# EAGLE design ece411-t10-ChargerBase (EAGLE 7.2.0)
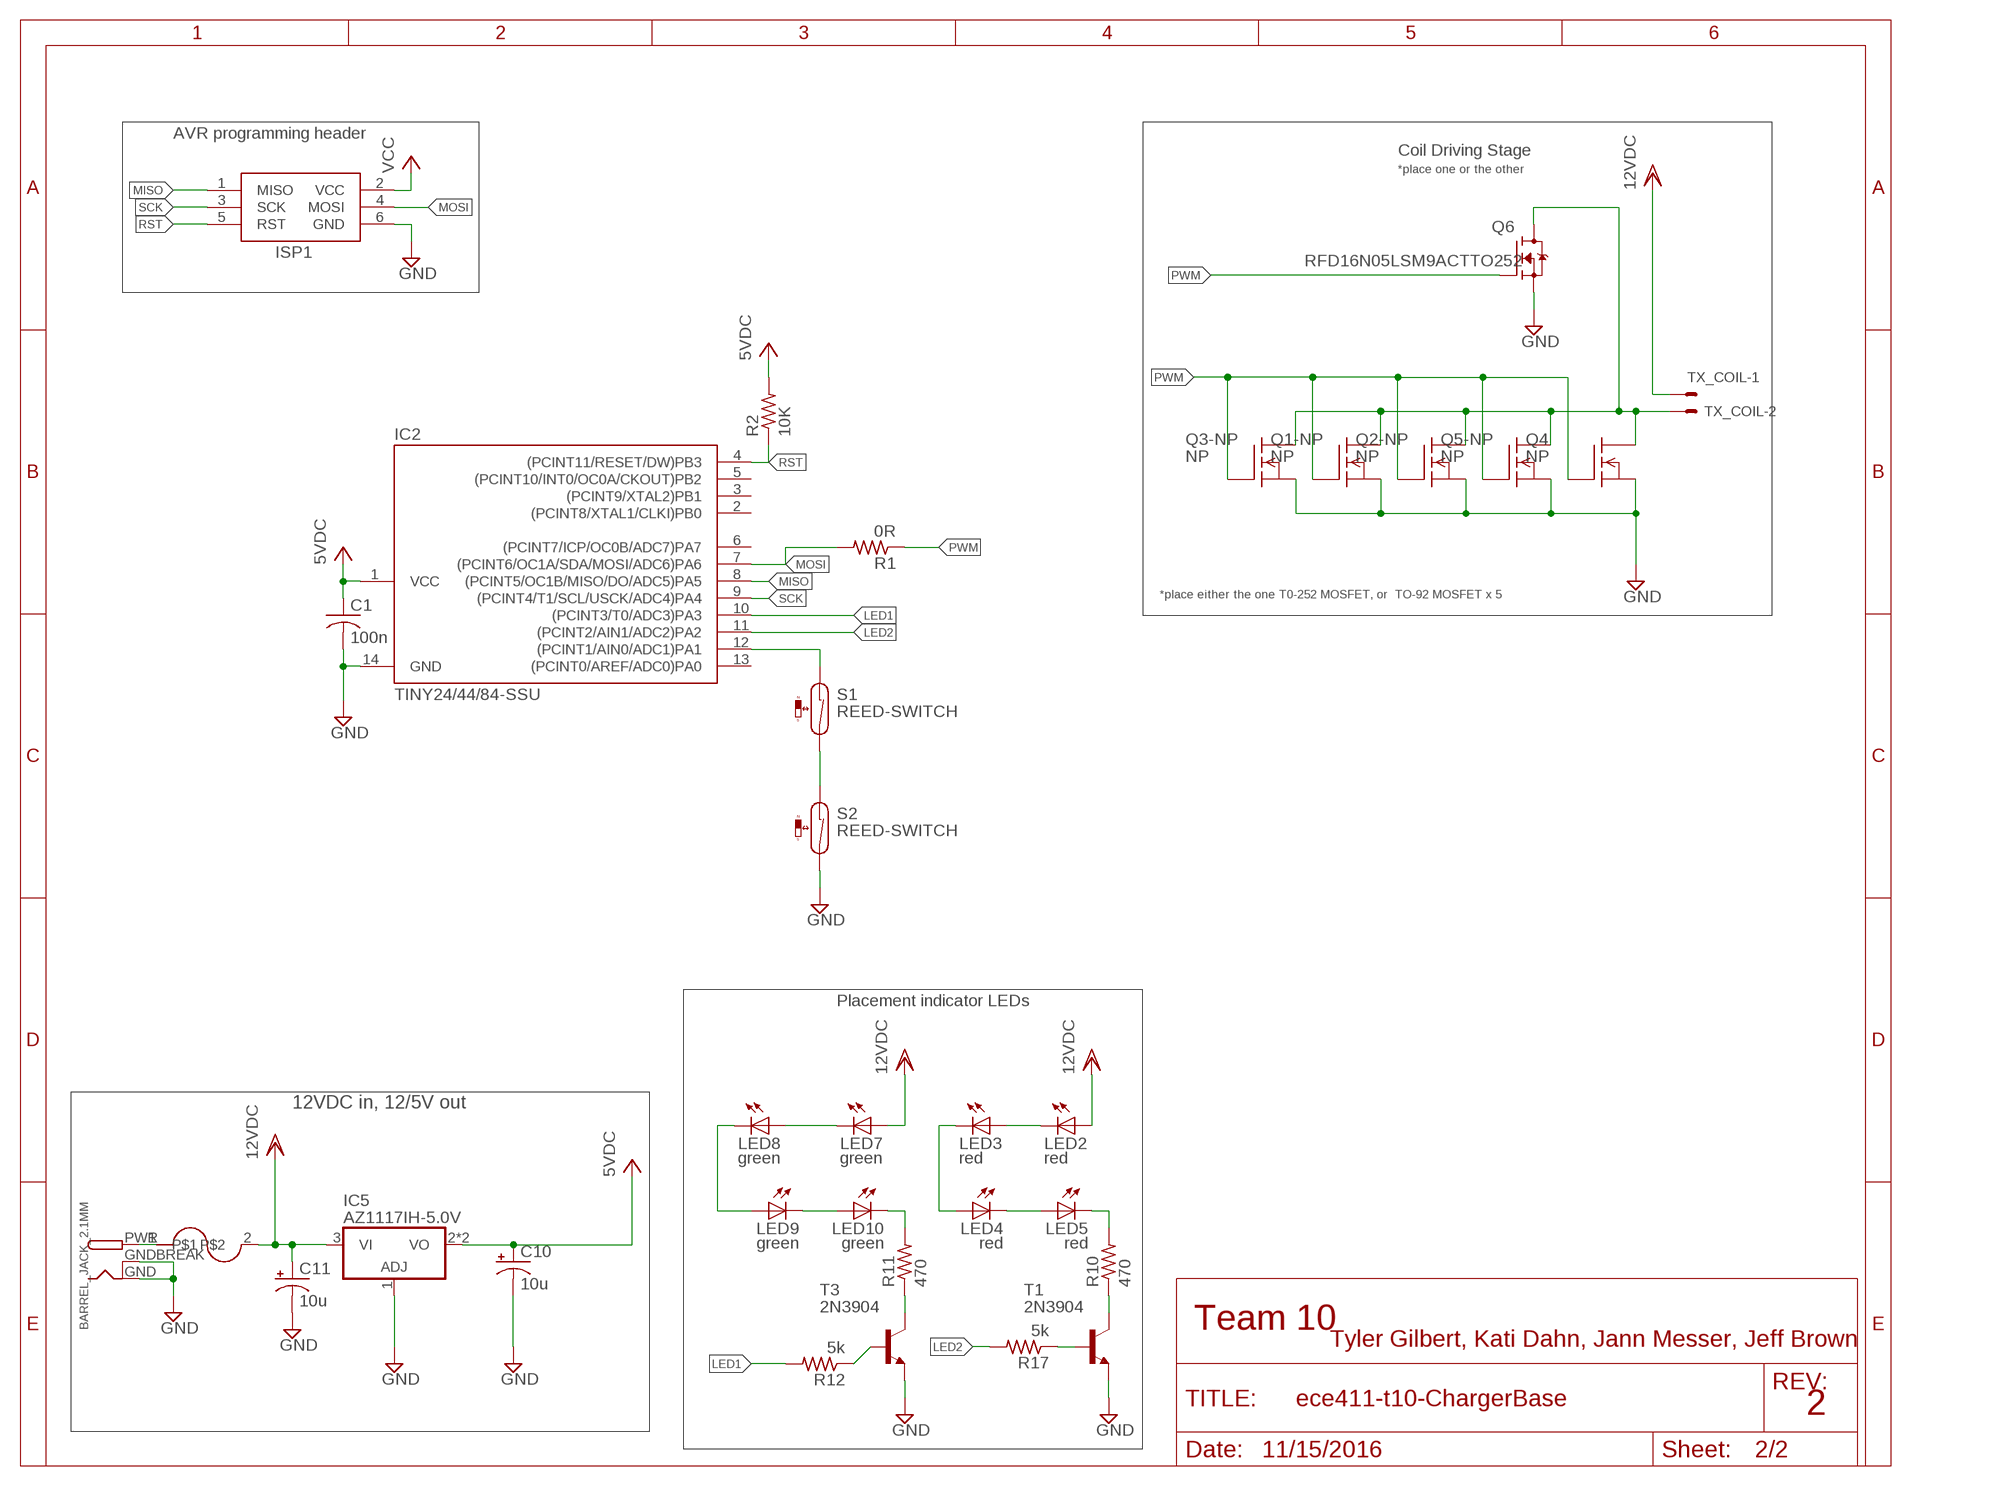
[diagram p0: schematic, sheet 1]

## Parts
BARREL_JACK_2.1MM  DCBARRELPTH  [DCJACK_2MM_PTH]
C1  100n  C-USC0805  [C0805]
C10  10u  CPOL-USE2-5  [E2-5]
C11  10u  CPOL-USE2-5  [E2-5]
IC2  TINY24/44/84-SSU  [SOIC14]
IC5  AZ1117IH-5.0V  317EMP  [SOT223]
ISP1  AVRISP-6  [AVRISP]
LED2  red  LEDCHIPLED_0805  [CHIPLED_0805]
LED3  red  LEDCHIPLED_0805  [CHIPLED_0805]
LED4  red  LEDCHIPLED_0805  [CHIPLED_0805]
LED5  red  LEDCHIPLED_0805  [CHIPLED_0805]
LED7  green  LEDCHIPLED_0805  [CHIPLED_0805]
LED8  green  LEDCHIPLED_0805  [CHIPLED_0805]
LED9  green  LEDCHIPLED_0805  [CHIPLED_0805]
LED10  green  LEDCHIPLED_0805  [CHIPLED_0805]
Q1-NP  NP  TN0602N3  [TO-92]
Q2-NP  NP  TN0602N3  [TO-92]
Q3-NP  NP  TN0602N3  [TO-92]
Q4  NP  TN0602N3  [TO-92]
Q5-NP  NP  TN0602N3  [TO-92]
Q6  RFD16N05LSM9ACTTO252  [TO252]
R1  0R  R-US_R0805  [R0805]
R2  10K  R-US_R0805  [R0805]
R10  470  R-US_R0805  [R0805]
R11  470  R-US_R0805  [R0805]
R12  5k  R-US_R0805  [R0805]
R17  5k  R-US_R0805  [R0805]
S1  REED-SWITCH  REED-SWITCH-MK6-6  [MK6-6]
S2  REED-SWITCH  REED-SWITCH-MK6-6  [MK6-6]
T1  2N3904  [TO92]
T3  2N3904  [TO92]
TX_COIL  22-23-2021  [22-23-2021]
U$1  LITTLEFUSE  [LITTLEFUSE]

## Nets
DRAIN: Q1-NP.3(D) Q2-NP.3(D) Q3-NP.3(D) Q4.3(D) Q5-NP.3(D) Q6.3(D) TX_COIL.2
GND: BARREL_JACK_2.1MM.GND BARREL_JACK_2.1MM.GNDBREAK C1.2 C10.- C11.- IC2.14(GND) IC5.1(ADJ) ISP1.6(GND) Q1-NP.1(S) Q2-NP.1(S) Q3-NP.1(S) Q4.1(S) Q5-NP.1(S) Q6.2(S) S2.2 T1.3(E) T3.3(E)
LED1: IC2.10((PCINT3/T0/ADC3)PA3) R12.2
LED2: IC2.11((PCINT2/AIN1/ADC2)PA2) R17.2
MISO: IC2.8((PCINT5/OC1B/MISO/DO/ADC5)PA5) ISP1.1(MISO)
MOSI: IC2.7((PCINT6/OC1A/SDA/MOSI/ADC6)PA6) ISP1.4(MOSI) R1.2
N$2: R11.1 T3.1(C)
N$6: LED10.C R11.2
N$7: BARREL_JACK_2.1MM.PWR U$1.1
N$14: R17.1 T1.2(B)
N$16: R10.1 T1.1(C)
N$17: LED5.C R10.2
N$18: LED2.C LED3.A
N$19: LED3.C LED4.A
N$20: LED4.C LED5.A
N$22: S1.2 S2.1
N$24: LED7.C LED8.A
N$25: LED8.C LED9.A
N$26: LED9.C LED10.A
N$33: R12.1 T3.2(B)
PIN12: IC2.12((PCINT1/AIN0/ADC1)PA1) S1.1
PWM: Q1-NP.2(G) Q2-NP.2(G) Q3-NP.2(G) Q4.2(G) Q5-NP.2(G) Q6.1(G) R1.1
RST: IC2.4((PCINT11/RESET/DW)PB3) ISP1.5(RST) R2.1
SCK: IC2.9((PCINT4/T1/SCL/USCK/ADC4)PA4) ISP1.3(SCK)
VCC: C1.1 C10.+ IC2.1(VCC) IC5.2(VO) IC5.4(VO) ISP1.2(VCC) R2.2 ; supply symbol labelled 5VDC
VDD: C11.+ IC5.3(VI) LED2.A LED7.A TX_COIL.1 U$1.2 ; supply symbol labelled 12VDC
Unconnected: IC2.2((PCINT8/XTAL1/CLKI)PB0) IC2.3((PCINT9/XTAL2)PB1) IC2.5((PCINT10/INT0/OC0A/CKOUT)PB2) IC2.6((PCINT7/ICP/OC0B/ADC7)PA7) IC2.13((PCINT0/AREF/ADC0)PA0)

## Notes on the sheet
- AVR programming header
- Coil Driving Stage
- *place one or the other
- *place either the one T0-252 MOSFET, or  TO-92 MOSFET x 5
- Placement indicator LEDs
- 12VDC in, 12/5V out

## Library data of the parts
BARREL_JACK_2.1MM = adafruit:DCBARREL: 2.0mm DC Barrel Jack DCJACK_2MM_PTH - Through Hole Jack (4UConnector: 05537)
C1 = rcl:C-US: CAPACITOR, American symbol
C10 C11 = adafruit:CPOL-US: POLARIZED CAPACITOR, American symbol
IC2 = avr-5:TINY24/44/84
IC5 = _VMS:*317: Positive VOLTAGE REGULATOR
ISP1 = adafruit:AVRISP: AVR ISP HEADER Standard 6 pin header for AVR programming
LED2-LED5 LED7-LED10 = led:LED: LED OSRAM: - CHIPLED LG R971, LG N971, LY N971, LG Q971, LY Q971, LO R971, LY R971 LH N974, LH R974 LS Q976, LO Q976, LY Q976 LO Q996 - Hyper CHIPLED LW Q18S LB Q993, LB Q99A, LB R99A - SideLED LS A670, LO A670, LY A670, LG A670, LP A670 LB A673, LV A673, LT A673, LW A673 LH A674 LY A675 LS A676, LA A676, LO A676, LY A676, LW A676 LS A679, LY A679, LG A679 - Hyper Micro SIDELED® LS Y876, LA Y876, LO Y876, LY Y876 LT Y87S - SmartLED LW L88C, LW L88S LB L89C, LB L89S, LG L890 LS L89K, LO L89K, LY L89K LS L896, LA L896, LO L896, LY L896 - TOPLED LS T670, LO T670, LY T670, LG T670, LP T670 LSG T670, LSP T670, LSY T670, LOP T670, LYG T670 LG T671, LOG T671, LSG T671 LB T673, LV T673, LT T673, LW T673 LH T674 LS T676, LA T676, LO T676, LY T676, LB T676, LH T676, LSB T676, LW T676 LB T67C, LV T67C, LT T67C, LS T67K, LO T67K, LY T67K, LW E67C LS E67B, LA E67B, LO E67B, LY E67B, LB E67C, LV E67C, LT E67C LW T67C LS T679, LY T679, LG T679 LS T770, LO T770, LY T770, LG T770, LP T770 LB T773, LV T773, LT T773, LW T773 LH T774 LS E675, LA E675, LY E675, LS T675 LS T776, LA T776, LO T776, LY T776, LB T776 LHGB T686 LT T68C, LB T68C - Hyper Mini TOPLED® LB M676 - Mini TOPLED Santana® LG M470 LS M47K, LO M47K, LY M47K Source: http://www.osram.convergy.de LUXEON: - LUMILED® LXK2-PW12-R00, LXK2-PW12-S00, LXK2-PW14-U00, LXK2-PW14-V00 LXK2-PM12-R00, LXK2-PM12-S00, LXK2-PM14-U00 LXK2-PE12-Q00, LXK2-PE12-R00, LXK2-PE12-S00, LXK2-PE14-T00, LXK2-PE14-U00 LXK2-PB12-K00, LXK2-PB12-L00, LXK2-PB12-M00, LXK2-PB14-N00, LXK2-PB14-P00, LXK2-PB14-Q00 LXK2-PR12-L00, LXK2-PR12-M00, LXK2-PR14-Q00, LXK2-PR14-R00 LXK2-PD12-Q00, LXK2-PD12-R00, LXK2-PD12-S00 LXK2-PH12-R00, LXK2-PH12-S00 LXK2-PL12-P00, LXK2-PL12-Q00, LXK2-PL12-R00 Source: www.luxeon.com KINGBRIGHT: KA-3528ASYC Source: www.kingbright.com
Q1-NP Q2-NP Q3-NP Q4 Q5-NP = transistor-fet:TN0602N3: N-Channel Enhancement MOSFET 20V; 4A; 0,75Ohm
Q6 = _VMS:RFD16N05LSM9ACT: P-Channel PowerTrench® MOSFET Source: FDD4141.pdf
R1 R2 R10-R12 R17 = rcl:R-US_: RESISTOR, American symbol
S1 S2 = switch-reed:REED-SWITCH-: Reed Sensor; OC_FARNELL: unknown
T1 T3 = transistor:2N3904: NPN TRANSISTOR
TX_COIL = con-molex:22-23-2021: .100" (2.54mm) Center Header - 2 Pin; MF: MOLEX; MPN: 22-23-2021; OC_FARNELL: 1462926; OC_NEWARK: 25C3832
U$1 = _VMS:LITTLEFUSE

## Board
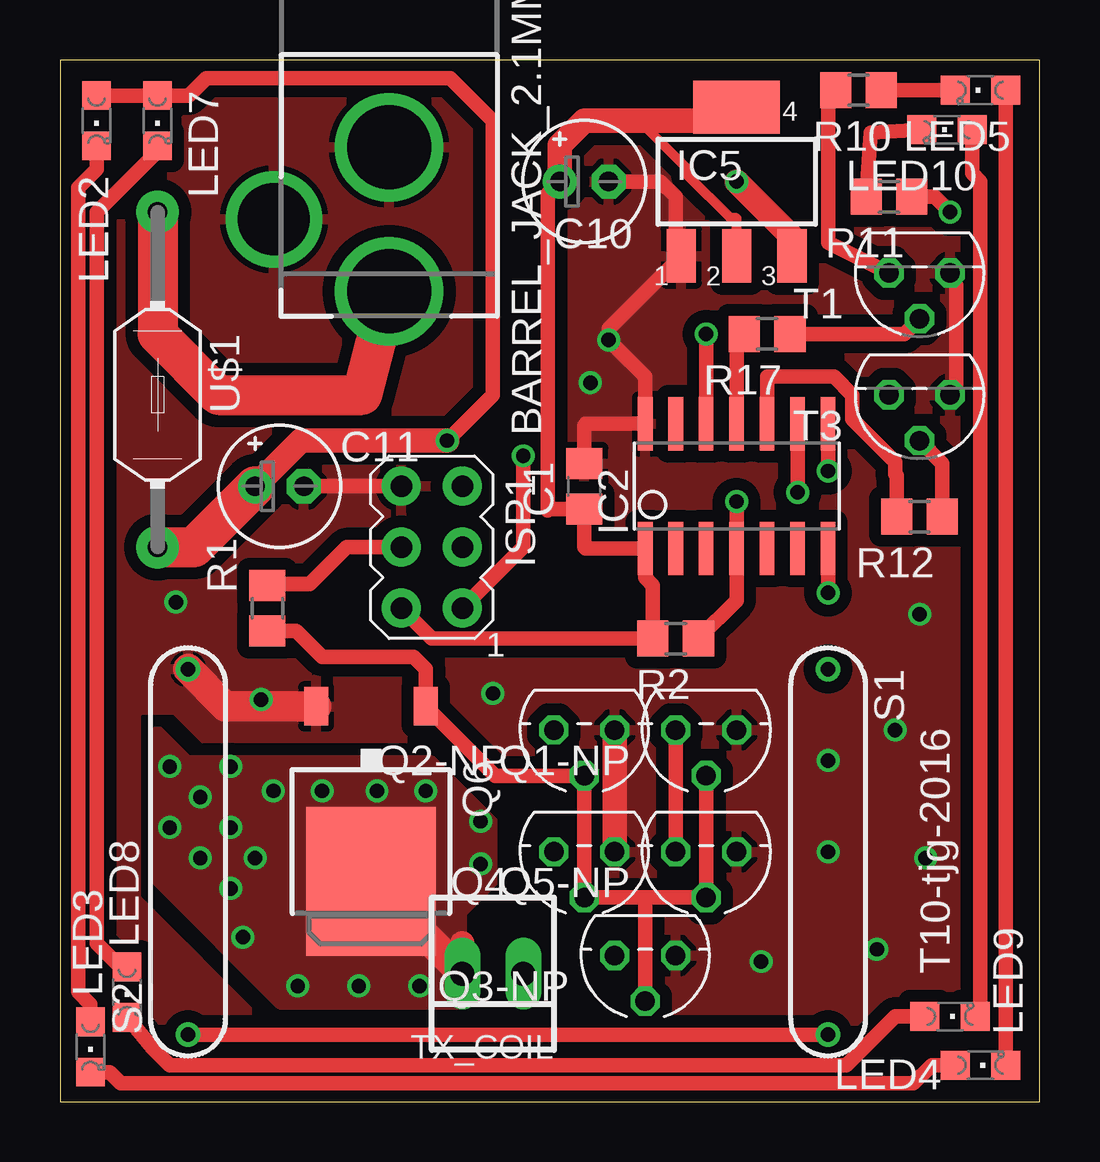
[diagram p1: board, top side]
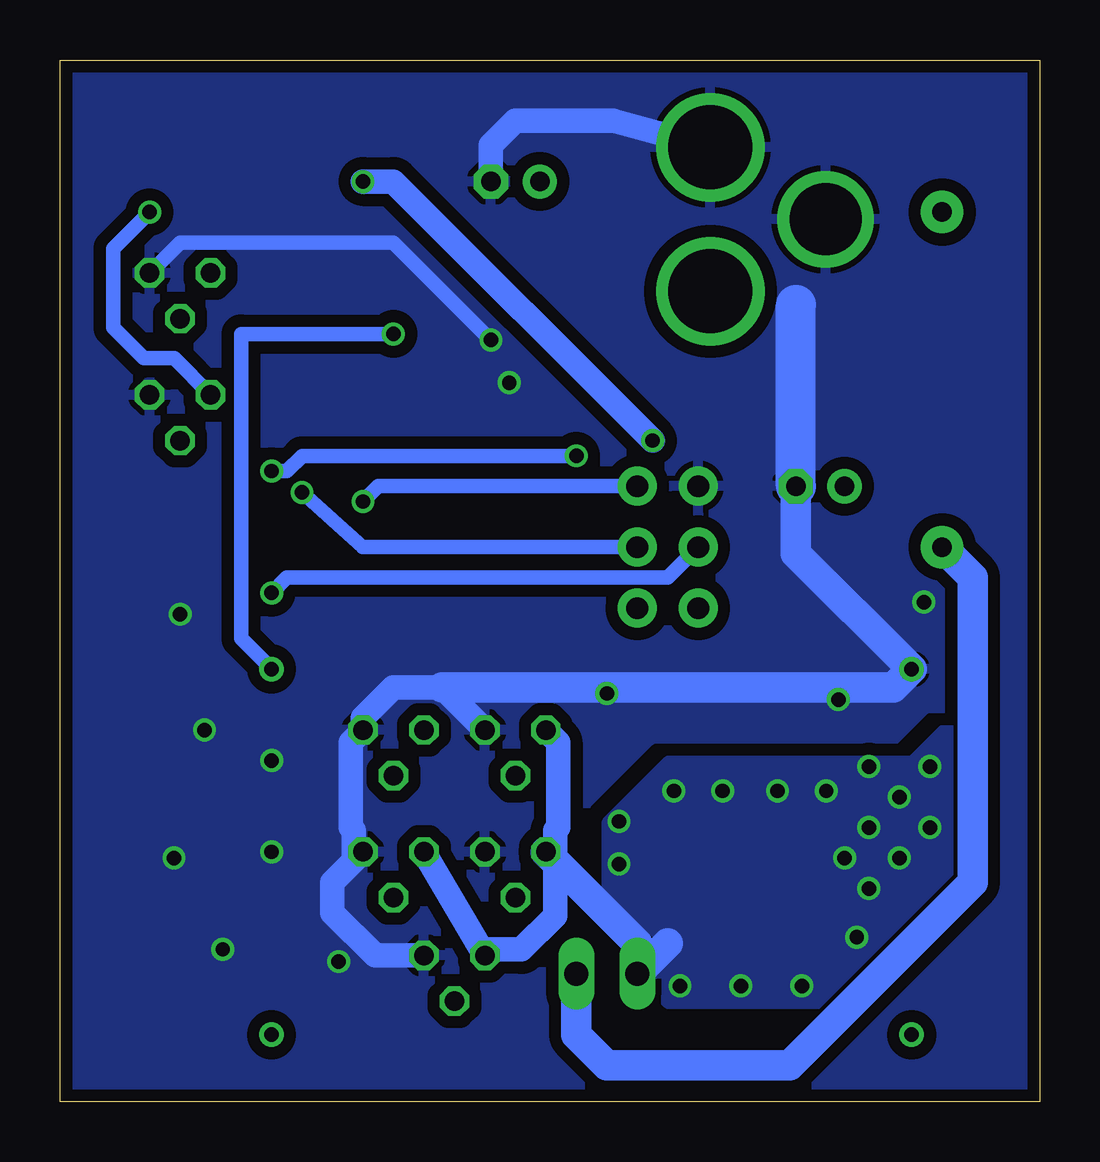
[diagram p2: board, bottom side, seen from below]

Size 40.82 x 43.42 mm. Coordinates in mm from the lower left corner, seen from the top.
Outline: 0,0 40.82,0 40.82,43.42 0,43.42 0,0
Copper layers (1*16): Top 0.0356mm / dielectric 1.5011mm / Bottom 0.0356mm
Design rules "oshpark-2layer": minimum track width 6mil, minimum drill 13mil, track to track 6mil, track to pad 6mil, pad to pad 6mil, via to via 6mil, smd to smd 6mil, copper to edge 15mil, drill to drill 6mil, minimum pad ring 7mil, minimum via ring 7mil, stop-mask expansion 2.5mil, vias tented up to drill 0mil, thermal gap 10mil

### Footprints (pad centres in the part's own frame; a part is rotated, then mirrored left to right if it is on the bottom)
DCJACK_2MM_PTH = drill 3.5: GND 0,3; PWR 0,-3 | drill 3: GNDBREAK -4.8,0
C0805 = smd 1.3 x 1.5: 1 -0.95,0; 2 0.95,0
E2-5 = drill 0.813 pad 1.422: + -1.016,0 | drill 0.813 pad 1.422 octagon: - 1.016,0
SOIC14 = smd 0.61 x 2.21: 1 -3.81,-2.603; 2 -2.54,-2.603; 3 -1.27,-2.603; 4 0,-2.603; 5 1.27,-2.603; 6 2.54,-2.603; 7 3.81,-2.603; 8 3.81,2.603; 9 2.54,2.603; 10 1.27,2.603; 11 0,2.603; 12 -1.27,2.603; 13 -2.54,2.603; 14 -3.81,2.603
SOT223 = smd 1.219 x 2.235: 1 -2.311,-3.099; 2 0,-3.099; 3 2.311,-3.099 | smd 3.6 x 2.2: 4 0,3.099
AVRISP = drill 0.9 pad 1.626: 1 -1.27,2.54; 2 1.27,2.54; 3 -1.27,0; 4 1.27,0; 5 -1.27,-2.54; 6 1.27,-2.54
CHIPLED_0805 = smd 1.2 x 1.2: A 0,-1.05; C 0,1.05
TO-92 = drill 0.813 octagon: 1 -1.27,0; 2 0,1.905; 3 1.27,0
TO252 = smd 1 x 1.6: 1 -2.28,-4.8; 2 2.28,-4.8 | smd 5.4 x 6.2: 3 0,2.5
R0805 = smd 1.3 x 1.5: 1 -0.95,0; 2 0.95,0
MK6-6 = drill 0.6 pad 1.016: 1 -7.62,0; 2 7.62,0
TO92 = drill 0.813 octagon: 1 1.27,0; 2 0,1.905; 3 -1.27,0
22-23-2021 = drill 1 long: 1 -1.27,0; 2 1.27,0
LITTLEFUSE = drill 0.813 pad 1.778: 1 -7.62,0; 2 6.35,0

### Placement (x,y rotation side)
BARREL_JACK_2.1MM  13.72,36.78 0 top
C1  21.84,25.65 90 top
C10  21.84,38.35 0 top
C11  9.14,25.65 0 top
IC2  28.19,25.65 0 top
IC5  28.19,38.35 0 top
ISP1  15.49,23.11 180 top
LED2  1.52,40.89 180 top
LED3  1.27,2.29 180 top
LED4  38.35,1.52 270 top
LED5  38.35,42.16 90 top
LED7  4.06,40.89 180 top
LED8  2.79,4.57 180 top
LED9  37.08,3.56 270 top
LED10  36.96,40.51 90 top
Q1-NP  26.92,15.49 180 top
Q2-NP  21.84,15.49 180 top
Q3-NP  24.38,6.1 180 top
Q4  21.84,10.41 180 top
Q5-NP  26.92,10.41 180 top
Q6  12.95,11.68 180 top
R1  8.64,20.57 90 top
R2  25.65,19.3 180 top
R10  33.27,42.16 0 top
R11  34.54,37.72 180 top
R12  35.81,24.38 180 top
R17  29.46,32 180 top
S1  32,10.41 270 top
S2  5.33,10.41 90 top
T1  35.81,34.54 180 top
T3  35.81,29.46 180 top
TX_COIL  18.03,5.33 180 top
U$1  4.06,29.46 270 top

### Tracks (layer width: path | path; a pad name or v marks a point on that pad's centre or on a via)
DRAIN  (via drill 0.6)
  Top 0.61: Q5-NP.3 Q1-NP.3
  Top 1.016: 16.76,5.37 16.76,6.6
  Top 1.27: Q6.3 16.76,5.37 TX_COIL.2
  Bottom 1.016: 20.19,10.03 Q4.3 | Q2-NP.3 20.07,14.99 20.07,11.43 20.19,11.3 20.19,10.03 | Q5-NP.3 Q3-NP.3 22.86,6.35 21.59,6.35 20.19,7.75 20.19,10.03
  Bottom 1.27: 15.49,6.6 TX_COIL.2 | 16.76,6.6 Q4.3
  other vias: 4.57,13.97 4.57,11.43 5.84,12.7 7.11,13.97 7.11,11.43 5.84,10.16 7.11,8.89 7.62,6.86 17.53,11.68 17.53,9.91 8.13,10.16 15.24,12.95 13.21,12.95 10.92,12.95 8.89,12.95 14.99,4.83 12.45,4.83 9.91,4.83
  pour Top (no thermals): 18.03,11.68 15.49,14.22 5.33,14.22 4.06,15.49 4.06,9.14 9.14,4.06 16.76,4.06 16.76,7.87 18.03,9.14
  pour Bottom: 18.03,11.68 15.49,14.22 5.33,14.22 4.06,15.49 2.79,15.49 2.79,9.14 2.79,7.87 6.6,4.06 15.49,4.06 16.76,5.33 16.76,6.6 18.03,7.87
GND  (via drill 0.6)
  Top 0.61: C1.2 21.84,28.19 21.91,28.26 IC2.14 24.38,30.23 v22.86,31.75 22.86,32.23 IC5.1 | C10.- 25.02,38.35 25.65,37.72 25.65,35.48 IC5.1 | ISP1.6 C11.- | T3.3 37.34,29.72 37.34,34.04 37.08,34.29 T1.3 | IC5.1 25.65,35.03
  Top 1.016: Q4.1 Q2-NP.1
  Top 1.27: Q6.2 6.88,16.48 S2.2
  Bottom 0.61: T1.3 35.81,35.81 26.92,35.81 v22.86,31.75
  Bottom 1.016: C10.- 22.86,39.88 21.84,40.89 17.76,40.89 BARREL_JACK_2.1MM.GND | Q2-NP.1 24.89,17.27 26.92,17.27 28.19,16 Q1-NP.1 28.7,14.99 28.7,11.43 28.58,11.3 28.58,10.03 | Q3-NP.1 27.69,6.1 29.46,7.87 29.46,9.14 28.58,10.03 | 28.58,10.03 Q5-NP.1
  Bottom 1.27: C11.- 10.16,22.86 S2.2 6.1,17.27 24.89,17.27
  Bottom 1.676: C11.- 10.16,33.22
  other vias: 32,10.41 34.04,6.35 35.81,20.32 34.8,15.49 22.1,29.97 4.83,20.83 8.38,16.76 18.03,17.02 36.07,10.16 32,14.22 29.21,5.84
  pour Bottom (isolate 0.508, rank 2): 0.25,43.43 0.25,0.25 40.89,0.25 40.89,43.43
  pour Top (isolate 0.508, rank 2): 0.25,43.43 0.25,0.25 40.89,0.25 40.89,43.43
LED1
  Top 0.61: IC2.10 29.46,30.23 32.26,30.23 33.02,29.46 33.02,28.45 34.8,26.67 34.8,26.16 34.86,26.1 R12.2
LED2
  Top 0.61: IC2.11 28.19,31.68 R17.2
MISO  (via drill 0.6)
  Top 0.61: ISP1.1 19.3,23.11 v19.3,26.92 | v32,26.29 IC2.8
  Bottom 0.61: v19.3,26.92 30.73,26.92 31.37,26.29 v32,26.29
MOSI  (via drill 0.6)
  Top 0.61: v32,21.21 IC2.7 | ISP1.4 11.94,23.11 10.41,21.59 8.7,21.59 R1.2
  Bottom 0.61: ISP1.4 15.49,21.84 31.37,21.84 v32,21.21
N$2  (via drill 0.6)
  Top 0.61: v37.08,37.08 36.45,37.72 R11.1
  Bottom 0.61: T3.1 36.07,30.99 37.34,30.99 38.61,32.26 38.61,35.56 v37.08,37.08
N$6
  Top 0.61: LED10.C 33.78,40.39 R11.2
N$7
  Top 1.676: U$1.1 4.06,32 6.6,29.46 12.58,29.46 BARREL_JACK_2.1MM.PWR
N$14
  Top 0.61: T1.2 35.18,32 R17.1
N$16
  Top 0.61: R10.1 32,42.16 32,35.81 T1.1
N$17
  Top 0.61: R10.2 LED5.C
N$18
  Top 0.61: LED2.C 1.52,38.86 0.76,38.1 0.76,4.57 1.27,4.06 LED3.A
N$19
  Top 0.61: LED3.C 2.07,1.24 2.54,0.76 35.56,0.76 36.32,1.52 LED4.A
N$20
  Top 0.61: LED5.A LED4.C
N$22
  Top 0.61: S1.2 S2.1
N$24
  Top 0.61: LED7.C 4.06,39.62 1.52,37.08 1.52,6.6 2.79,5.33 LED8.A
N$25
  Top 0.61: LED8.C 3.84,2.25 4.57,1.52 32.77,1.52 34.8,3.56 LED9.A
N$26
  Top 0.61: LED9.C 38.35,3.78 38.35,38.35 38.01,38.7 LED10.A
N$33
  Top 0.61: T3.2 36.76,26.61 R12.1
PIN12  (via drill 0.6)
  Top 0.61: v26.92,32 IC2.12
  Bottom 0.61: S1.1 33.27,19.3 33.27,32 v26.92,32
PWM
  Top 0.61: Q1-NP.2 Q5-NP.2 24.38,8.51 | 24.38,8.51 Q4.2 Q2-NP.2 18.13,13.59 Q6.1 15.24,18.03 14.73,18.54 10.92,18.54 9.84,19.62 R1.1 | Q3-NP.2 24.38,8.51
RST  (via drill 0.6)
  Top 0.61: R2.1 28.19,20.89 IC2.4 v28.19,25.02
  Bottom 0.61: ISP1.5 27.56,25.65 v28.19,25.02
SCK  (via drill 0.6)
  Top 0.61: v30.73,25.4 IC2.9
  Bottom 0.61: ISP1.3 28.19,23.11 v30.73,25.4
VCC
  Top 0.406: IC5.2 28.19,36.83 27.94,36.83 26.16,38.61 26.16,38.86 24.13,40.89
  Top 0.61: ISP1.2 15.49,19.3 R2.2 24.7,21.52 24.38,21.84 IC2.1 21.91,23.05 21.84,23.11 C1.1 20.39,24.7 20.32,24.64 20.32,37.85 C10.+
  Top 1.016: C10.+ 20.83,39.88 21.84,40.89 24.13,40.89 27.64,40.89 IC5.4
VDD  (via drill 0.6)
  Top 0.61: C11.+ 8.13,25.91 9.14,26.92 | LED2.A LED7.A 5.37,41.94 6.1,42.67 16.26,42.67 18.03,40.89 18.03,29.46 v16.13,27.56
  Top 1.016: IC5.3 30.51,36.04 v28.19,38.35 | v16.13,27.56 10.03,27.56 C11.+
  Top 1.676: U$1.2 5.59,23.11 C11.+
  Bottom 1.016: v28.19,38.35 26.92,38.35 v16.13,27.56
  Bottom 1.27: TX_COIL.1 19.3,2.79 18.03,1.52 10.41,1.52 2.79,9.14 2.79,21.84 U$1.2

### Text on the board
tNames: T10-tjg-2016